# Altium schematic sheet power-afe.SchDoc: Analog Front End Power
size Letter; CheckedBy: J. Brinton; CompanyName: Signal Laboratories, Inc.; DrawnBy: J. Brinton; Engineer: J. Brinton; Address1: 3479 Edison Way; Address2: Menlo Park CA 94025; Address3: +1 (877) 778-8435; Address4: siglabs.com; Revision: 3; SheetNumber: 4; SheetTotal: 49
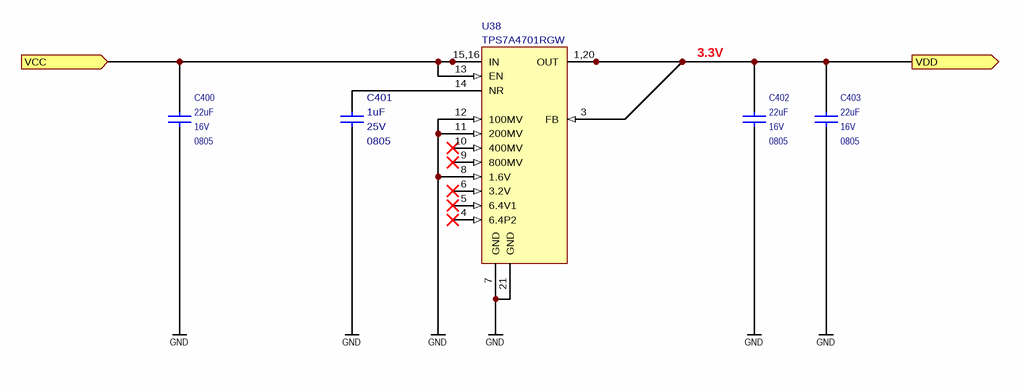
[diagram p0: power-afe.SchDoc]

## Parts
C400  value 22uF  Voltage: 16V  Package: 0805  [CAPC200X125X145L45N]  (hidden comment: C2012X5R1C226K125AC)
C401  value 1uF  Package: 0805  Voltage: 25V  [CAPC200X125X145L45N]  (hidden comment: TMK212B7105KG)
C402  value 22uF  Voltage: 16V  Package: 0805  [CAPC200X125X145L45N]  (hidden comment: C2012X5R1C226K125AC)
C403  value 22uF  Voltage: 16V  Package: 0805  [CAPC200X125X145L45N]  (hidden comment: C2012X5R1C226K125AC)
U38  TPS7A4701RGW  [QFN65P500X500X100-21N]

## Ports
VCC (in), VDD (out)

## Nets
GND: C400.1 C401.2 C402.1 C403.1 U38.7(GND) U38.8(1.6V) U38.11(200MV) U38.12(100MV) U38.21(GND)
VCC: C400.2 U38.13(EN) U38.15(IN) U38.16(IN) ; port VCC
VDD: C402.2 C403.2 U38.1(OUT) U38.3(FB) U38.20(OUT) ; port VDD
NetC401_1: C401.1 U38.14(NR)

Not connected (* = marked no-connect by the designer): U38 4(6.4P2)* 5(6.4V1)* 6(3.2V)* 9(800MV)* 10(400MV)*

## Notes on the sheet
- 3.3V
- Title
- Engineer
- Revision
- Drawn By
- Checked By
- Date
- Sheet
- of
- (in symbol TPS7A4701RGW_1) 15,16; 1,20

## Library data of the parts
C400 C402 C403 = CAP 0603: Ceramic Capacitor 22uF ±10% 16V X5R 0805; Manufacturer: TDK; Tr: -55:85; Manufacturer P/N: C2012X5R1C226K125AC; Tolerance: ±10%
C401 = TMK212B7105KG: Ceramic Capacitor 1uF ±10% 25V X7R 0805; Manufacturer: Taiyo Yuden; Manufacturer P/N: TMK212B7105KG; Tolerance: ±10%; Tr: *
U38 = TPS7A4701RGW_1: Low-Dropout Linear Regulator 20-VQFN; Manufacturer: Texas Instruments; Manufacturer P/N: TPS7A4701RGW; Package: VQFN-20